# Altium schematic sheet FMC_SINGLE_LPC_BREAKOUT.SchDoc: Connector (LPC) breakout, Commercial grade mounting
size A4; Date: 18.12.2017; DrawnBy: PFH; Engineer: PFH; DocumentNumber: 1; Revision: A; SheetNumber: 1; SheetTotal: 1; Projekt: FMC module (single width), Low-pin count breakout; Website: www.fmchub.com; ProjectName: FMC_Single_LPC_BREAKOUT
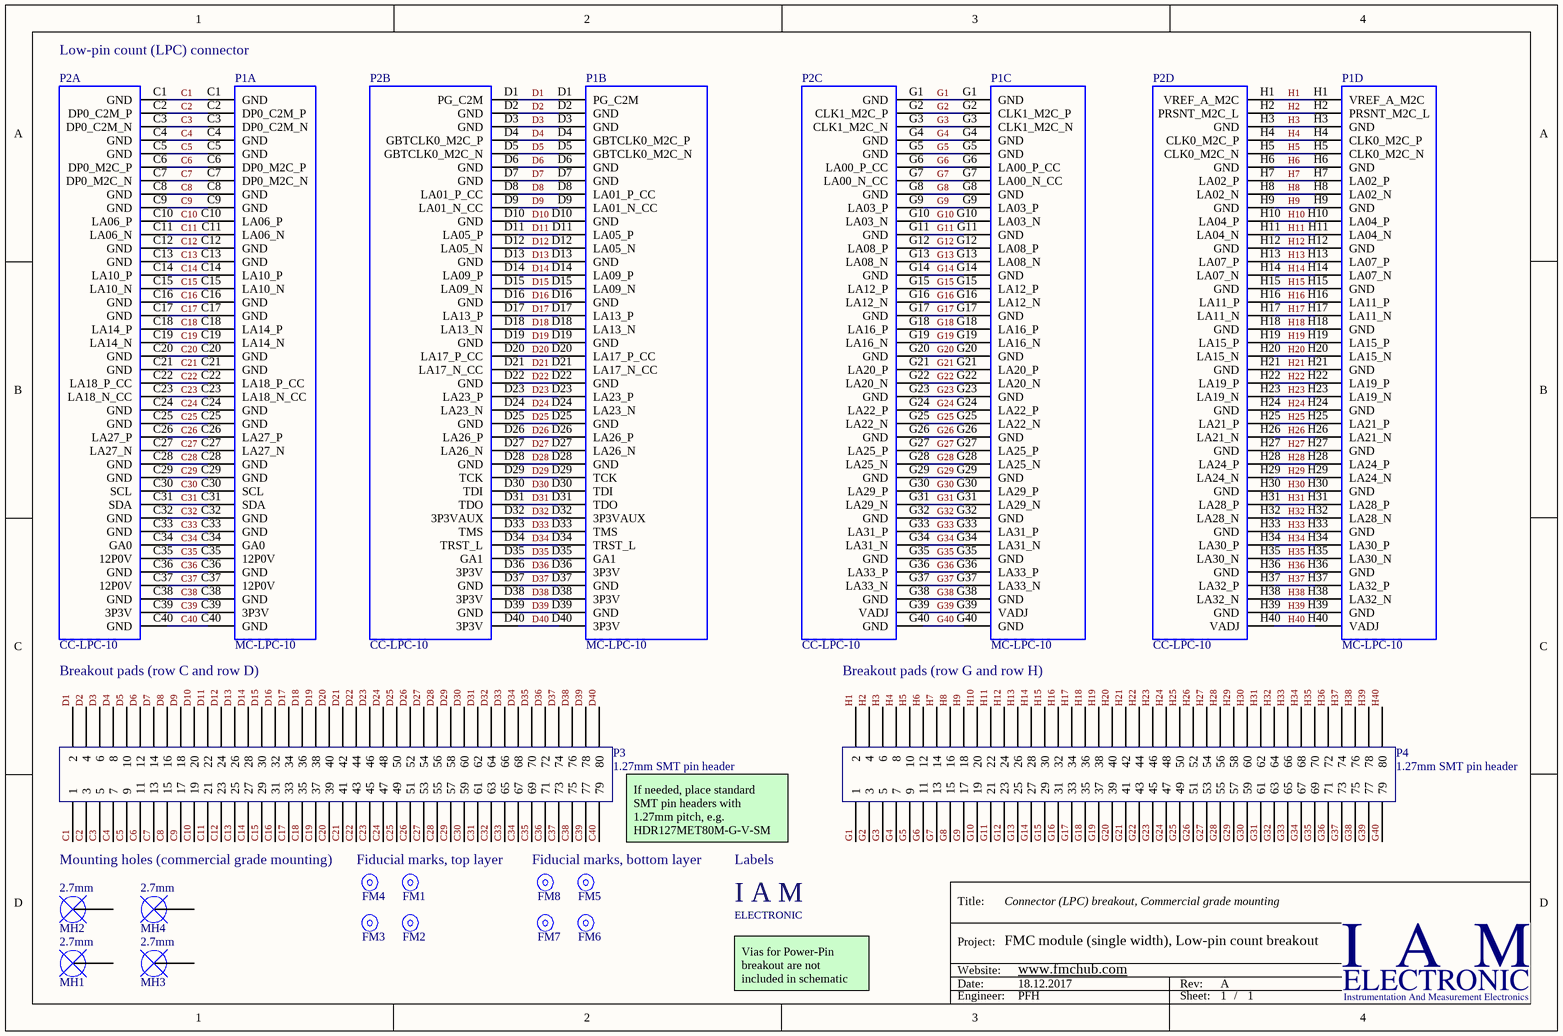
[diagram p0: FMC_SINGLE_LPC_BREAKOUT.SchDoc]

## Parts
FM1  1mm  [FIDUCIAL_MARK_ROUND]  (value not drawn)  (no BOM)
FM2  1mm  [FIDUCIAL_MARK_ROUND]  (value not drawn)  (no BOM)
FM3  1mm  [FIDUCIAL_MARK_ROUND]  (value not drawn)  (no BOM)
FM4  1mm  [FIDUCIAL_MARK_ROUND]  (value not drawn)  (no BOM)
FM5  1mm  [FIDUCIAL_MARK_ROUND]  (value not drawn)  (no BOM)
FM6  1mm  [FIDUCIAL_MARK_ROUND]  (value not drawn)  (no BOM)
FM7  1mm  [FIDUCIAL_MARK_ROUND]  (value not drawn)  (no BOM)
FM8  1mm  [FIDUCIAL_MARK_ROUND]  (value not drawn)  (no BOM)
MH1  2.7mm  [Mounting_Hole_Plated_2.7mm - d3.1mm]  (no BOM)
MH2  2.7mm  [Mounting_Hole_Plated_2.7mm - d3.1mm]  (no BOM)
MH3  2.7mm  [Mounting_Hole_Plated_2.7mm-COVERED]  (no BOM)
MH4  2.7mm  [Mounting_Hole_Plated_2.7mm-COVERED]  (no BOM)
P1  MC-LPC-10  [ASP-134604-01]  (parts A,B,C,D of 4)
P2  CC-LPC-10  [ASP-134603-01]  (parts A,B,C,D of 4)
P3  1.27mm SMT pin header  [FTS-140-01-L-DV-A]  (no BOM)
P4  1.27mm SMT pin header  [FTS-140-01-L-DV-A]  (no BOM)
STR1  IAM LOGO  [IAM LOGO - MEDIUM]  (value not drawn)  (no BOM)

## Nets
C1: P1.C1(GND) P2.C1(GND) P3.1
C2: P1.C2(DP0_C2M_P) P2.C2(DP0_C2M_P) P3.3
C3: P1.C3(DP0_C2M_N) P2.C3(DP0_C2M_N) P3.5
C4: P1.C4(GND) P2.C4(GND) P3.7
C5: P1.C5(GND) P2.C5(GND) P3.9
C6: P1.C6(DP0_M2C_P) P2.C6(DP0_M2C_P) P3.11
C7: P1.C7(DP0_M2C_N) P2.C7(DP0_M2C_N) P3.13
C8: P1.C8(GND) P2.C8(GND) P3.15
C9: P1.C9(GND) P2.C9(GND) P3.17
C10: P1.C10(LA06_P) P2.C10(LA06_P) P3.19
C11: P1.C11(LA06_N) P2.C11(LA06_N) P3.21
C12: P1.C12(GND) P2.C12(GND) P3.23
C13: P1.C13(GND) P2.C13(GND) P3.25
C14: P1.C14(LA10_P) P2.C14(LA10_P) P3.27
C15: P1.C15(LA10_N) P2.C15(LA10_N) P3.29
C16: P1.C16(GND) P2.C16(GND) P3.31
C17: P1.C17(GND) P2.C17(GND) P3.33
C18: P1.C18(LA14_P) P2.C18(LA14_P) P3.35
C19: P1.C19(LA14_N) P2.C19(LA14_N) P3.37
C20: P1.C20(GND) P2.C20(GND) P3.39
C21: P1.C21(GND) P2.C21(GND) P3.41
C22: P1.C22(LA18_P_CC) P2.C22(LA18_P_CC) P3.43
C23: P1.C23(LA18_N_CC) P2.C23(LA18_N_CC) P3.45
C24: P1.C24(GND) P2.C24(GND) P3.47
C25: P1.C25(GND) P2.C25(GND) P3.49
C26: P1.C26(LA27_P) P2.C26(LA27_P) P3.51
C27: P1.C27(LA27_N) P2.C27(LA27_N) P3.53
C28: P1.C28(GND) P2.C28(GND) P3.55
C29: P1.C29(GND) P2.C29(GND) P3.57
C30: P1.C30(SCL) P2.C30(SCL) P3.59
C31: P1.C31(SDA) P2.C31(SDA) P3.61
C32: P1.C32(GND) P2.C32(GND) P3.63
C33: P1.C33(GND) P2.C33(GND) P3.65
C34: P1.C34(GA0) P2.C34(GA0) P3.67
C35: P1.C35(12P0V) P2.C35(12P0V) P3.69
C36: P1.C36(GND) P2.C36(GND) P3.71
C37: P1.C37(12P0V) P2.C37(12P0V) P3.73
C38: P1.C38(GND) P2.C38(GND) P3.75
C39: P1.C39(3P3V) P2.C39(3P3V) P3.77
C40: P1.C40(GND) P2.C40(GND) P3.79
D1: P1.D1(PG_C2M) P2.D1(PG_C2M) P3.2
D2: P1.D2(GND) P2.D2(GND) P3.4
D3: P1.D3(GND) P2.D3(GND) P3.6
D4: P1.D4(GBTCLK0_M2C_P) P2.D4(GBTCLK0_M2C_P) P3.8
D5: P1.D5(GBTCLK0_M2C_N) P2.D5(GBTCLK0_M2C_N) P3.10
D6: P1.D6(GND) P2.D6(GND) P3.12
D7: P1.D7(GND) P2.D7(GND) P3.14
D8: P1.D8(LA01_P_CC) P2.D8(LA01_P_CC) P3.16
D9: P1.D9(LA01_N_CC) P2.D9(LA01_N_CC) P3.18
D10: P1.D10(GND) P2.D10(GND) P3.20
D11: P1.D11(LA05_P) P2.D11(LA05_P) P3.22
D12: P1.D12(LA05_N) P2.D12(LA05_N) P3.24
D13: P1.D13(GND) P2.D13(GND) P3.26
D14: P1.D14(LA09_P) P2.D14(LA09_P) P3.28
D15: P1.D15(LA09_N) P2.D15(LA09_N) P3.30
D16: P1.D16(GND) P2.D16(GND) P3.32
D17: P1.D17(LA13_P) P2.D17(LA13_P) P3.34
D18: P1.D18(LA13_N) P2.D18(LA13_N) P3.36
D19: P1.D19(GND) P2.D19(GND) P3.38
D20: P1.D20(LA17_P_CC) P2.D20(LA17_P_CC) P3.40
D21: P1.D21(LA17_N_CC) P2.D21(LA17_N_CC) P3.42
D22: P1.D22(GND) P2.D22(GND) P3.44
D23: P1.D23(LA23_P) P2.D23(LA23_P) P3.46
D24: P1.D24(LA23_N) P2.D24(LA23_N) P3.48
D25: P1.D25(GND) P2.D25(GND) P3.50
D26: P1.D26(LA26_P) P2.D26(LA26_P) P3.52
D27: P1.D27(LA26_N) P2.D27(LA26_N) P3.54
D28: P1.D28(GND) P2.D28(GND) P3.56
D29: P1.D29(TCK) P2.D29(TCK) P3.58
D30: P1.D30(TDI) P2.D30(TDI) P3.60
D31: P1.D31(TDO) P2.D31(TDO) P3.62
D32: P1.D32(3P3VAUX) P2.D32(3P3VAUX) P3.64
D33: P1.D33(TMS) P2.D33(TMS) P3.66
D34: P1.D34(TRST_L) P2.D34(TRST_L) P3.68
D35: P1.D35(GA1) P2.D35(GA1) P3.70
D36: P1.D36(3P3V) P2.D36(3P3V) P3.72
D37: P1.D37(GND) P2.D37(GND) P3.74
D38: P1.D38(3P3V) P2.D38(3P3V) P3.76
D39: P1.D39(GND) P2.D39(GND) P3.78
D40: P1.D40(3P3V) P2.D40(3P3V) P3.80
G1: P1.G1(GND) P2.G1(GND) P4.1
G2: P1.G2(CLK1_M2C_P) P2.G2(CLK1_M2C_P) P4.3
G3: P1.G3(CLK1_M2C_N) P2.G3(CLK1_M2C_N) P4.5
G4: P1.G4(GND) P2.G4(GND) P4.7
G5: P1.G5(GND) P2.G5(GND) P4.9
G6: P1.G6(LA00_P_CC) P2.G6(LA00_P_CC) P4.11
G7: P1.G7(LA00_N_CC) P2.G7(LA00_N_CC) P4.13
G8: P1.G8(GND) P2.G8(GND) P4.15
G9: P1.G9(LA03_P) P2.G9(LA03_P) P4.17
G10: P1.G10(LA03_N) P2.G10(LA03_N) P4.19
G11: P1.G11(GND) P2.G11(GND) P4.21
G12: P1.G12(LA08_P) P2.G12(LA08_P) P4.23
G13: P1.G13(LA08_N) P2.G13(LA08_N) P4.25
G14: P1.G14(GND) P2.G14(GND) P4.27
G15: P1.G15(LA12_P) P2.G15(LA12_P) P4.29
G16: P1.G16(LA12_N) P2.G16(LA12_N) P4.31
G17: P1.G17(GND) P2.G17(GND) P4.33
G18: P1.G18(LA16_P) P2.G18(LA16_P) P4.35
G19: P1.G19(LA16_N) P2.G19(LA16_N) P4.37
G20: P1.G20(GND) P2.G20(GND) P4.39
G21: P1.G21(LA20_P) P2.G21(LA20_P) P4.41
G22: P1.G22(LA20_N) P2.G22(LA20_N) P4.43
G23: P1.G23(GND) P2.G23(GND) P4.45
G24: P1.G24(LA22_P) P2.G24(LA22_P) P4.47
G25: P1.G25(LA22_N) P2.G25(LA22_N) P4.49
G26: P1.G26(GND) P2.G26(GND) P4.51
G27: P1.G27(LA25_P) P2.G27(LA25_P) P4.53
G28: P1.G28(LA25_N) P2.G28(LA25_N) P4.55
G29: P1.G29(GND) P2.G29(GND) P4.57
G30: P1.G30(LA29_P) P2.G30(LA29_P) P4.59
G31: P1.G31(LA29_N) P2.G31(LA29_N) P4.61
G32: P1.G32(GND) P2.G32(GND) P4.63
G33: P1.G33(LA31_P) P2.G33(LA31_P) P4.65
G34: P1.G34(LA31_N) P2.G34(LA31_N) P4.67
G35: P1.G35(GND) P2.G35(GND) P4.69
G36: P1.G36(LA33_P) P2.G36(LA33_P) P4.71
G37: P1.G37(LA33_N) P2.G37(LA33_N) P4.73
G38: P1.G38(GND) P2.G38(GND) P4.75
G39: P1.G39(VADJ) P2.G39(VADJ) P4.77
G40: P1.G40(GND) P2.G40(GND) P4.79
H1: P1.H1(VREF_A_M2C) P2.H1(VREF_A_M2C) P4.2
H2: P1.H2(PRSNT_M2C_L) P2.H2(PRSNT_M2C_L) P4.4
H3: P1.H3(GND) P2.H3(GND) P4.6
H4: P1.H4(CLK0_M2C_P) P2.H4(CLK0_M2C_P) P4.8
H5: P1.H5(CLK0_M2C_N) P2.H5(CLK0_M2C_N) P4.10
H6: P1.H6(GND) P2.H6(GND) P4.12
H7: P1.H7(LA02_P) P2.H7(LA02_P) P4.14
H8: P1.H8(LA02_N) P2.H8(LA02_N) P4.16
H9: P1.H9(GND) P2.H9(GND) P4.18
H10: P1.H10(LA04_P) P2.H10(LA04_P) P4.20
H11: P1.H11(LA04_N) P2.H11(LA04_N) P4.22
H12: P1.H12(GND) P2.H12(GND) P4.24
H13: P1.H13(LA07_P) P2.H13(LA07_P) P4.26
H14: P1.H14(LA07_N) P2.H14(LA07_N) P4.28
H15: P1.H15(GND) P2.H15(GND) P4.30
H16: P1.H16(LA11_P) P2.H16(LA11_P) P4.32
H17: P1.H17(LA11_N) P2.H17(LA11_N) P4.34
H18: P1.H18(GND) P2.H18(GND) P4.36
H19: P1.H19(LA15_P) P2.H19(LA15_P) P4.38
H20: P1.H20(LA15_N) P2.H20(LA15_N) P4.40
H21: P1.H21(GND) P2.H21(GND) P4.42
H22: P1.H22(LA19_P) P2.H22(LA19_P) P4.44
H23: P1.H23(LA19_N) P2.H23(LA19_N) P4.46
H24: P1.H24(GND) P2.H24(GND) P4.48
H25: P1.H25(LA21_P) P2.H25(LA21_P) P4.50
H26: P1.H26(LA21_N) P2.H26(LA21_N) P4.52
H27: P1.H27(GND) P2.H27(GND) P4.54
H28: P1.H28(LA24_P) P2.H28(LA24_P) P4.56
H29: P1.H29(LA24_N) P2.H29(LA24_N) P4.58
H30: P1.H30(GND) P2.H30(GND) P4.60
H31: P1.H31(LA28_P) P2.H31(LA28_P) P4.62
H32: P1.H32(LA28_N) P2.H32(LA28_N) P4.64
H33: P1.H33(GND) P2.H33(GND) P4.66
H34: P1.H34(LA30_P) P2.H34(LA30_P) P4.68
H35: P1.H35(LA30_N) P2.H35(LA30_N) P4.70
H36: P1.H36(GND) P2.H36(GND) P4.72
H37: P1.H37(LA32_P) P2.H37(LA32_P) P4.74
H38: P1.H38(LA32_N) P2.H38(LA32_N) P4.76
H39: P1.H39(GND) P2.H39(GND) P4.78
H40: P1.H40(VADJ) P2.H40(VADJ) P4.80

Not connected (* = marked no-connect by the designer): FM1 FD0; FM2 FD0; FM3 FD0; FM4 FD0; FM5 FD0; FM6 FD0; FM7 FD0; FM8 FD0; MH1 0; MH2 0; MH3 0; MH4 0

## Notes on the sheet
- Low-pin count (LPC) connector
- Breakout pads (row C and row D)
- Breakout pads (row G and row H)
- If needed, place standard
  SMT pin headers with
  1.27mm pitch, e.g.
  HDR127MET80M-G-V-SM
- (near FM4) Mounting holes (commercial grade mounting)
- Fiducial marks, top layer
- Fiducial marks, bottom layer
- (near STR1) Labels
- Vias for Power-Pin
  breakout are not
  included in schematic
- Title:
- Project:
- Date:
- Website:
- Rev:
- Engineer:
- Sheet:
- /
- (in symbol IAM_LOGO) I A M; ELECTRONIC

## Library data of the parts
FM1-FM8 = Fiducial_Mark: Fiducial mark, width 1mm, clearance 3mm; Width: 1 mm; Clearance: 3 mm
MH1-MH4 = Mounting_Hole_2.7mm: Mounting hole, hole size 2.7mm; Hole radius: 2.7 mm; Diameter (plated): *; Keep out (radius): *; Plated: *
P1 = MC-LPC-10: MC-LPC-10, FMC Low-pin count connector, lead free, 160 I/Os, male, 10 mm mated stack height; Manufacturer: Samtec; Manufacturer Ref: SEAM-40-03.5-S-10-2-A-K-TR-VITA57; Pitch: 1.27 mm; Mated Stack Height: 10 mm; Solder Type: Lead-Free; Number I/O: 160; PartName: ASP-134604-01; Part: ASP-134604-01; Vita PartNumber: MC-LPC-10; Pin Count: Low; Gender: male; Digi-Key Part Number: SAM8732-ND
P2 = CC-LPC-10: CC-LPC-10, FMC Low-pin count connector, lead free, 160 I/Os, female, 10 mm mated stack height; Manufacturer: Samtec; Manufacturer Ref: SEAF-40-06.5-10-A; Pitch: 1.27 mm; Mated Stack Height: 10 mm; Solder Type: Lead-Free; Number I/O: 160; PartName: ASP-134603-01; Part: ASP-134603-01; Vita PartNumber: CC-LPC-10; Pin Count: Low; Gender: female; Digi-Key Part Number: SAM8729-ND
P3 P4 = FTS-140-X-DV: 1.27 MM 80 PIN VERTICAL MALE HEADER; Manufacturer_NOSTOCK: Samtec; Part: HDR127MET80M-G-V-SM; Manufacturer: Chip Quik Inc.; Part_NOSTOCK: FTS-140-01-L-DV-A; Pitch: 1.27 mm; Digi-Key Part Number: HDR127MET80M-G-V-SM-ND
STR1 = IAM_LOGO: I A M E L E C T R O N I C - Logo; Layer: Top Overlay; Manufacturer: IAM ELECTRONIC; Part: Logo